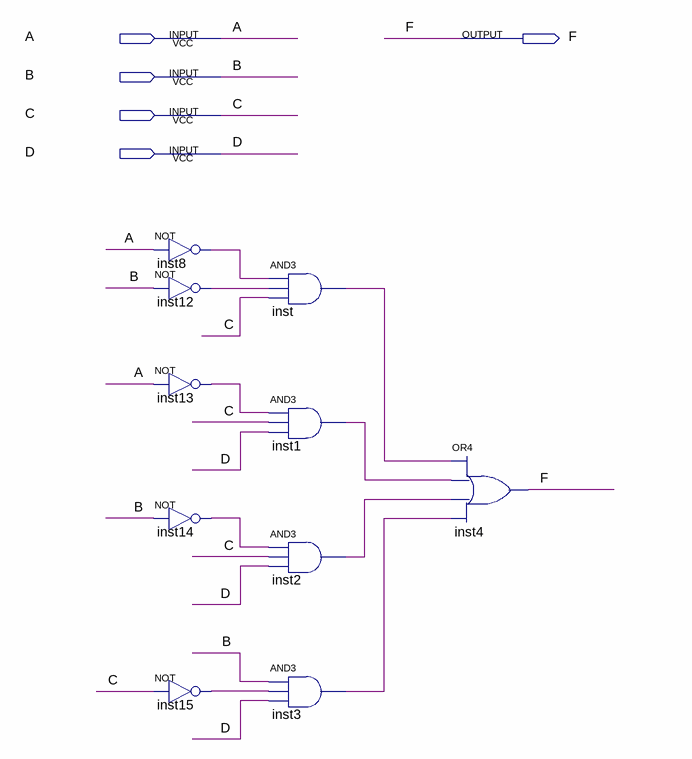
[diagram p0: schematic sheet]
// Quartus schematic prime.bdf as structural Verilog: 10 symbols, 5 pins
module prime (
  input  A,
  input  B,
  input  C,
  input  D,
  output F
);

  wire inst1_out, inst2_out, inst3_out, inst8_out, inst12_out, inst13_out, inst14_out, inst15_out, inst_out;

  not inst8 (inst8_out, A);
  not inst12 (inst12_out, B);
  not inst13 (inst13_out, A);
  not inst14 (inst14_out, B);
  not inst15 (inst15_out, C);
  and inst (inst_out, inst8_out, inst12_out, C);
  and inst1 (inst1_out, inst13_out, C, D);
  and inst2 (inst2_out, inst14_out, C, D);
  and inst3 (inst3_out, B, inst15_out, D);
  or inst4 (F, inst_out, inst1_out, inst2_out, inst3_out);
endmodule
